# EAGLE design human (EAGLE 9.0.1)
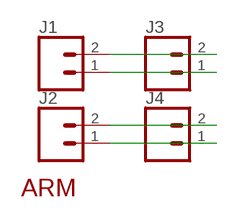
[diagram p0: schematic, sheet 1]

## Parts
J1  CONN_02LOCK  [1X02_LOCK]
J2  CONN_02LOCK  [1X02_LOCK]
J3  CONN_02LOCK  [1X02_LOCK]
J4  CONN_02LOCK  [1X02_LOCK]
U$1  ARMHUMAN  [HUMAN]

## Nets
V1: J1.1 J3.1
V2: J1.2 J3.2
V3: J2.1 J4.1
V4: J2.2 J4.2

## Library data of the parts
J1-J4 = SparkFun-Connectors:CONN_02: Multi connection point. Often used as Generic Header-pin footprint for 0.1 inch spaced/style header connections On any of the 0.1 inch spaced packages, you can populate with these: Break Away Headers - Straight <https://www.sparkfun.com/products/116> (PRT-00116) Break Away Male Headers - Right Angle <https://www.sparkfun.com/products/553> (PRT-00553) Female Headers <https://www.sparkfun.com/products/115> (PRT-00115) Break Away Headers - Machine Pin <https://www.sparkfun.com/products/117> (PRT-00117) Break Away Female Headers - Swiss Machine Pin <https://www.sparkfun.com/products/743> (PRT-00743) For SCREWTERMINALS and SPRING TERMINALS visit here: Screw Terimnals on SparkFun.com <https://www.sparkfun.com/search/results?term=Screw+Terminals> (5mm/3.5mm/2.54mm spacing) This device is also useful as a general connection point to wire up your design to another part of your project. Our various solder wires solder well into these plated through hole pads. Hook-Up Wire - Assortment (Stranded, 22 AWG) <https://www.sparkfun.com/products/11375> (PRT-11375) Hook-Up Wire - Assortment (Solid Core, 22 AWG) <https://www.sparkfun.com/products/11367> (PRT-11367) View the entire wire category on our website here <https://www.sparkfun.com/categories/141> Special notes: Molex polarized connector foot print use with: PRT-08233 with associated crimp pins and housings. 2.54_SCREWTERM for use with PRT-10571. 3.5mm Screw Terminal footprints for PRT-08084 5mm Screw Terminal footprints for use with PRT-08432
U$1 = arms:ARM

## Board
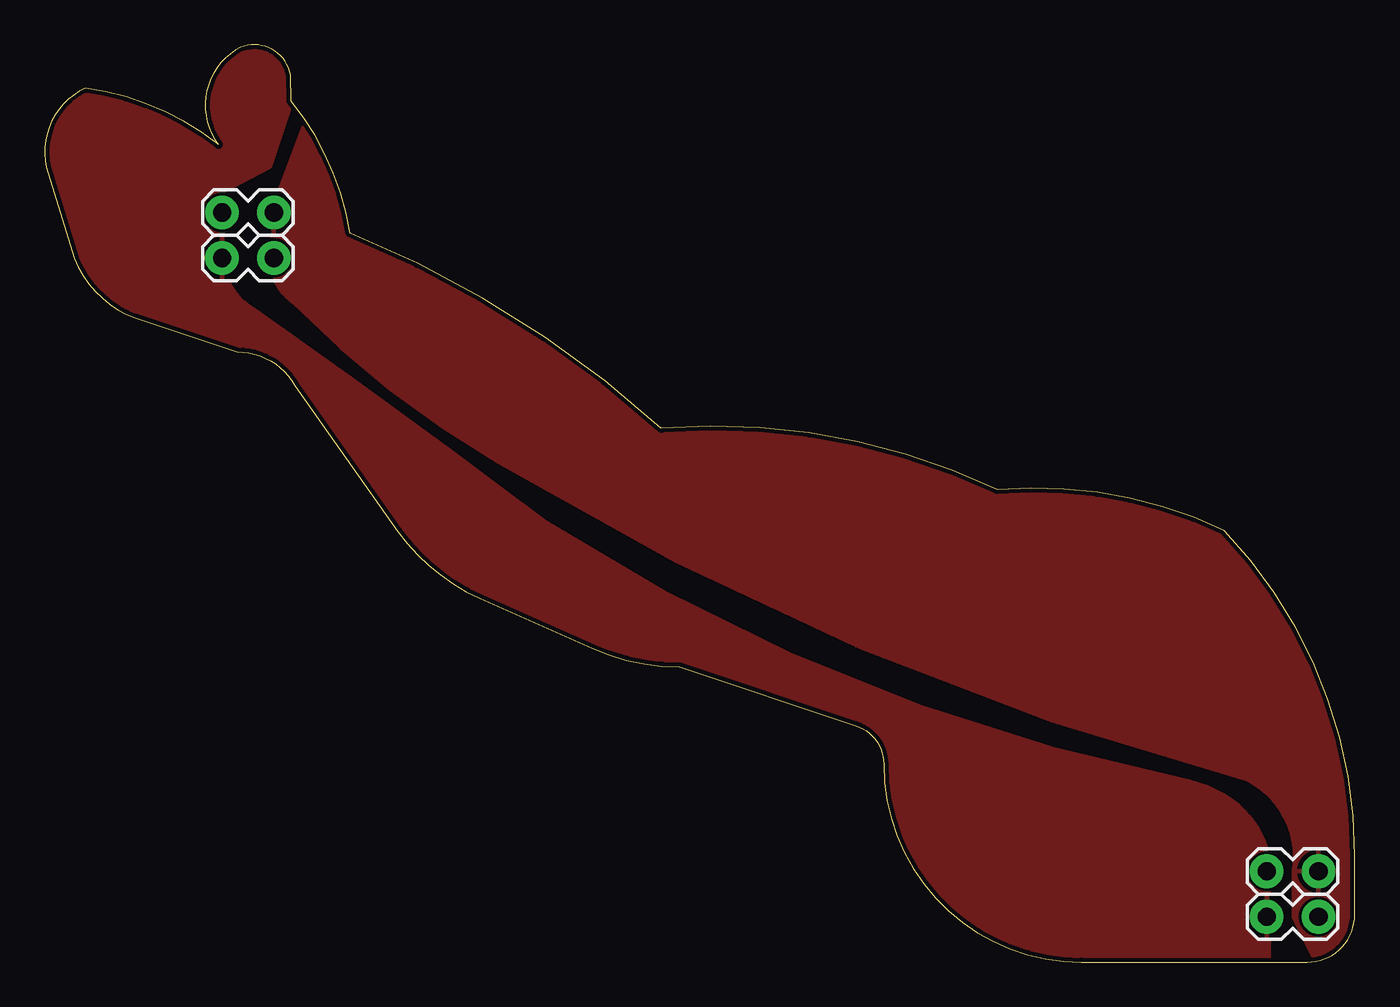
[diagram p1: board, top side]
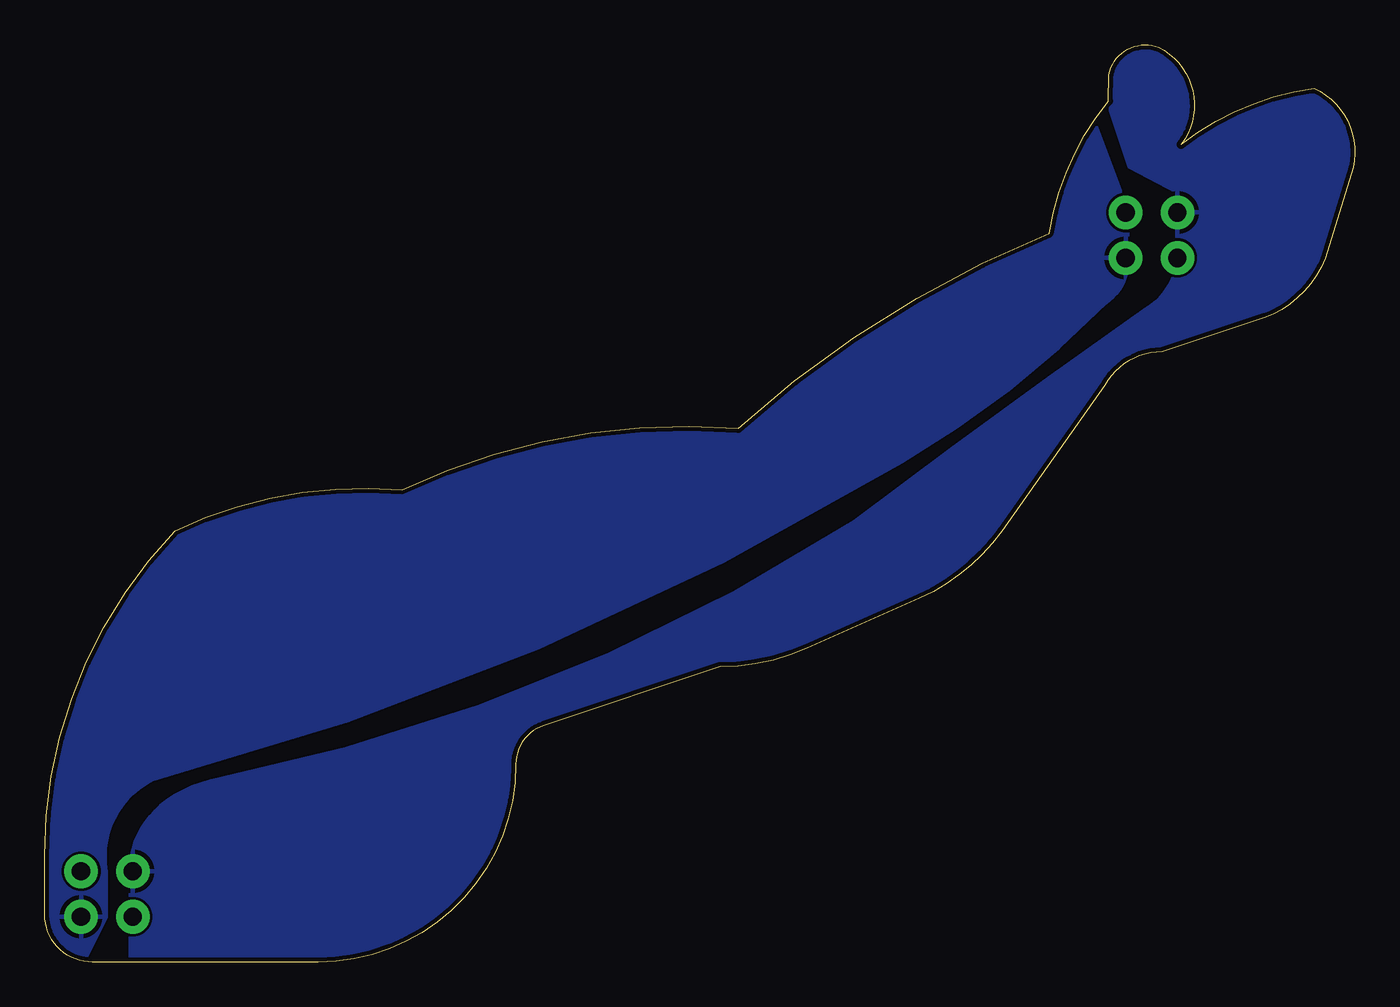
[diagram p2: board, bottom side, seen from below]

Size 73.27 x 51.29 mm. Coordinates in mm from the lower left corner, seen from the top.
Outline: 46.93,11.06 arc90 57.98,0 70.6,0 arc90 73.27,2.67 73.27,5.95 arc44 65.98,24.13 arc30 53.28,26.42 arc30 34.48,29.84 arc20 17.08,40.76 arc30 13.78,48.13 13.75,49.62 arc100 10.95,51.15 arc100 9.71,45.72 arc30 2.27,48.87 arc83 0.19,44.06 1.66,39.35 arc54 5.58,35.85 10.77,34.12 arc-60 13.99,32.25 19.75,24.1 arc31 24.34,20.34 30.63,17.54 arc24 35.5,16.51 45.37,13.22 arc-72 46.93,11.06
Copper layers (1*16): Top 0.035mm / dielectric 1.5mm / Bottom 0.035mm
Design rules "default *": minimum track width 6mil, minimum drill 0.35mm, track to track 6mil, track to pad 6mil, pad to pad 6mil, via to via 6mil, smd to smd 6mil, copper to edge 10mil, drill to drill 6mil, minimum pad ring 10mil, minimum via ring 8mil, stop-mask expansion 4mil, vias tented up to drill 0mil, thermal gap 10mil

### Footprints (pad centres in the part's own frame; a part is rotated, then mirrored left to right if it is on the bottom)
1X02_LOCK = drill 1.016 pad 1.88: 1 -0.178,0; 2 2.718,0

### Placement (x,y rotation side)
J1  68.52,5.08 0 top
J2  68.52,2.54 0 top
J3  10.1,41.91 0 top
J4  10.1,39.37 0 top
U$1  1.21,10.16 0 top

### Tracks (layer width: path | path; a pad name or v marks a point on that pad's centre or on a via)
V1
  pour Bottom: 68.52,0 68.52,5.08 arc55 66.48,9.02 arc22 63.94,10.16 arc-21 28,24.64 arc2 11.62,36.58 arc-55 9.97,39.37 9.97,43.05 12.64,44.45 15.18,52.07 -0.06,52.07 -0.06,0
V2
  pour Top: 69.79,2.54 69.79,5.08 arc74 67.25,10.16 arc-16 25.34,27.94 arc-15 13.91,36.83 arc-57 12.64,39.37 arc4 12.64,41.91 16.45,52.07 73.6,52.07 73.6,0 71.06,0
V3
  pour Top: 68.52,0 68.52,5.08 arc55 66.48,9.02 arc22 63.94,10.16 arc-21 28,24.64 arc2 11.62,36.58 arc-55 9.97,39.37 9.97,43.05 12.64,44.45 15.18,52.07 -0.06,52.07 -0.06,0
V4
  pour Bottom: 69.79,2.54 69.79,5.08 arc74 67.25,10.16 arc-16 25.34,27.94 arc-15 13.91,36.83 arc-57 12.64,39.37 arc4 12.64,41.91 16.45,52.07 73.6,52.07 73.6,0 71.06,0

### Text on the board
tStop: by / @securelyfitz / git.io/sao-arms